# Altium schematic sheet ADC&Sensor&Relay.SchDoc
size A; SheetNumber: 6; SheetTotal: 6
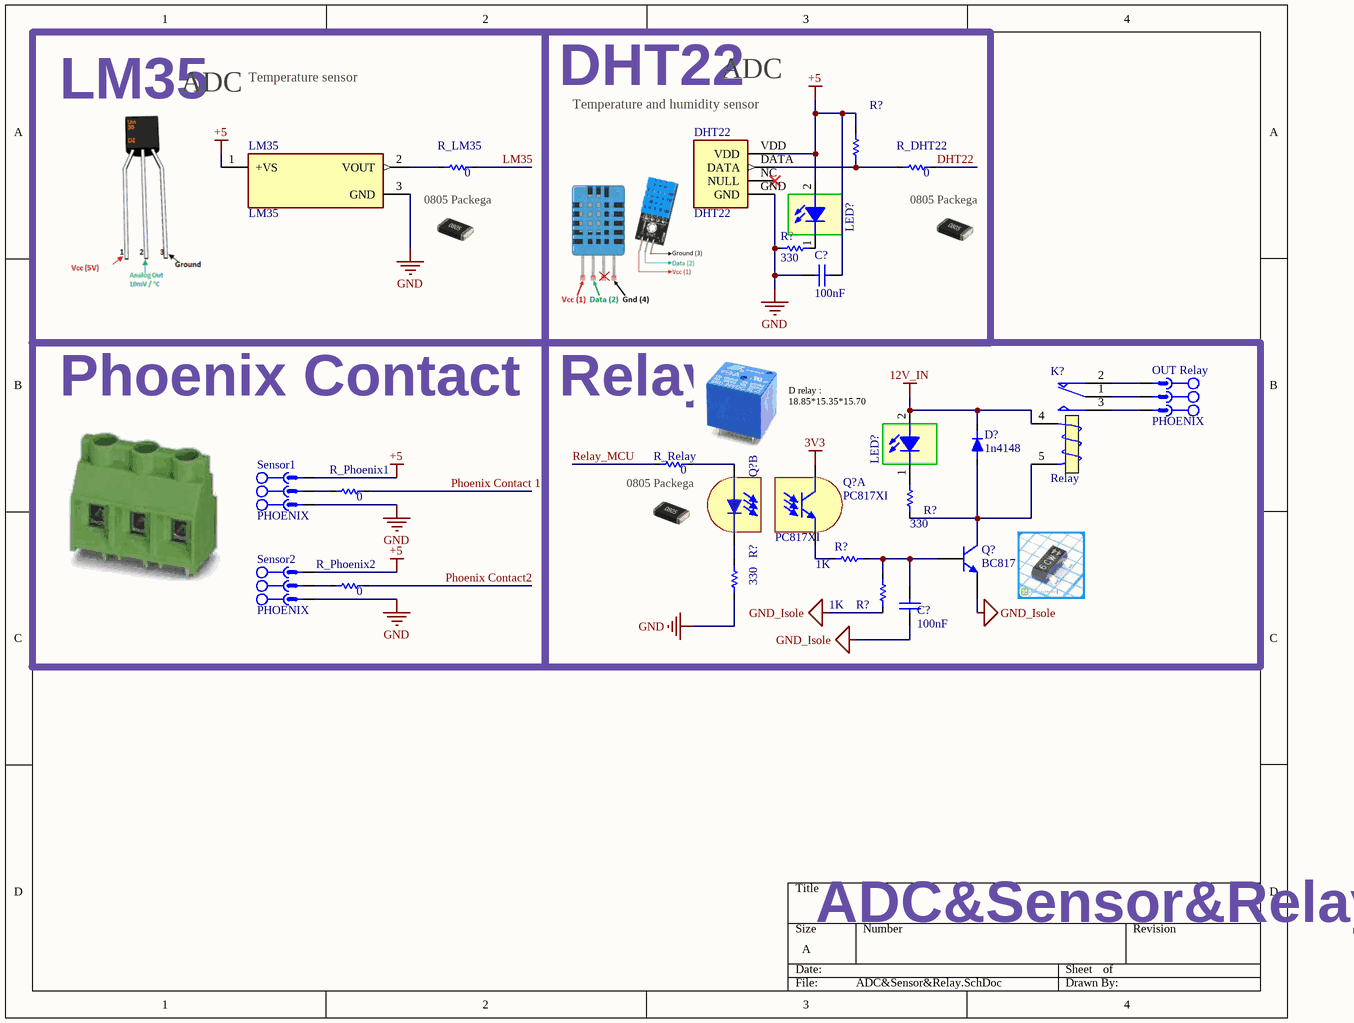
[diagram p0: ADC&Sensor&Relay.SchDoc]

## Parts
(Parts that share a designator on the sheet are numbered #1, #2 ... from top to bottom, then left to right.)
C?#1  100nF  [CAPC3413X12N]
C?#2  100nF  [MY_CAP_SMD_0603]
D?  1n4148  [SOD123]
DHT22  DHT22  [DHT22]
K?  Relay  [Relay 18.85x15.35x15.70]
LED?#1  SMD 1206 LED  [LED 1206]  (value not drawn)
LED?#2  SMD 1206 LED  [LED 1206]  (value not drawn)
LM35  LM35  [TO92127P521H735-3]
OUT_Relay  PHOENIX  [MSTB 2,5/3-G-5,08]
Q?#1  PC817XI  [SMT Gullwing Lead-Form]  (part B of 2)
Q?#2  PC817XI  [SMT Gullwing Lead-Form]  (part A of 2)
Q?#3  BC817  [SOT23_N]
R?#1  (no value)  [0805]
R?#2  330  [0805]
R?#3  330  [1206_Res]
R?#4  1K  [0805]
R?#5  1K  [0805]
R?#6  330  [1206_Res]
R_DHT22  0  [0805]
R_LM35  0  [0805]
R_Phoenix1  0  [0805]
R_Phoenix2  0  [0805]
R_Relay  0  [0805]
Sensor1  PHOENIX  [MSTB 2,5/3-G-5,08]
Sensor2  PHOENIX  [MSTB 2,5/3-G-5,08]

## Blocks framed on the sheet
LM35: LM35 R_LM35
DHT22: C?#1 DHT22 LED?#1 R?#1 R?#2 R_DHT22
Phoenix Contact: R_Phoenix1 R_Phoenix2 Sensor1 Sensor2
Relay: C?#2 D? K? LED?#2 OUT_Relay Q?#1-Q?#3 R?#3-R?#6 R_Relay

## Nets
3V3: Q?#2.4(C)
12V_IN: D?.2(K) K?.4(T1) LED?#2.2
+5: C?#1.2 DHT22.VDD LED?#1.2 LM35.1(+VS) R?#1.2 Sensor1.3 Sensor2.3
GND: C?#1.1 DHT22.GND LM35.3(GND) R?#2.1 R?#6.1 Sensor1.1 Sensor2.1
GND_Isole: C?#2.2 Q?#3.2(E) R?#5.2
DHT22: R_DHT22.2
LM35: R_LM35.2
Phoenix Contact2: R_Phoenix2.2
Phoenix Contact 1: R_Phoenix1.2
Relay_MCU: R_Relay.1
NetC?#2_1: C?#2.1 Q?#3.1(B) R?#4.2 R?#5.1
NetD?_1: D?.1(A) K?.5(T2) Q?#3.3(C) R?#3.1
NetDHT22_DATA: DHT22.DATA R?#1.1 R_DHT22.1
NetK?_1: K?.1(COM) OUT_Relay.2
NetK?_2: K?.2(NC) OUT_Relay.1
NetK?_3: K?.3(NO) OUT_Relay.3
NetLED?#1_1: LED?#1.1 R?#2.2
NetLED?#2_1: LED?#2.1 R?#3.2
NetLM35_2: LM35.2(VOUT) R_LM35.1
NetQ?#1_1: Q?#1.1(A) R_Relay.2
NetQ?#1_2: Q?#1.2(K) R?#6.2
NetQ?#2_3: Q?#2.3(E) R?#4.1
NetR_Phoenix1_1: R_Phoenix1.1 Sensor1.2
NetR_Phoenix2_1: R_Phoenix2.1 Sensor2.2

Not connected (* = marked no-connect by the designer): DHT22 NC(NULL)*

## Notes on the sheet
- ADC
- Temperature sensor
- (near DHT22) Temperature and humidity sensor
- 0805 Packega
- (near R_DHT22) 0805 Packega
- (near LED?#2) D relay : 18.85*15.35*15.70
- (near R_Relay) 0805 Packega
- ADC&Sensor&Relay

## Library data of the parts
C?#1 = CAP SMD 0805: CAP 0805; Designer: Abbas Basereh; Desc.: CAP SMD 0805; Data: 16-12-2016
C?#2 = CAP SMD_0603: 1.6 mm × 0.8 mm
D? = Diode
DHT22 = DHT22: Capacitive-type humidity and temperature module/sensor; MF: Aosong Electronics; SnapEDA_Link: https://www.snapeda.com/parts/DHT22/Aosong+Electronics/view-part/?ref=snap; Package: Package; Value: *; MP: DHT22; Check_prices: https://www.snapeda.com/parts/DHT22/Aosong+Electronics/view-part/?ref=eda
K? = Relay: SPDT Relay; Designer: Eng. Saeid Jorablo; Company: E.P.I.L; Design_Date: 2011/10/31
LED?#1 LED?#2 = LED SMD 1206
LM35 = LM35DZ/NOPB: Temperature Sensor Analog, Local 0Â°C ~ 100Â°C 10mV/Â°C TO-92-3; MP: LM35DZ; MF: Texas Instruments; Price: None; Availability: In Stock; Package: E-PKG AXIAL-LEADED-2 ON Semiconductor; Value: *; SnapEDA_Link: https://www.snapeda.com/parts/LM35DZ/Texas+Instruments/view-part/?ref=snap; Purchase-URL: https://pricing.snapeda.com/search/part/LM35DZ/?ref=eda; Check_prices: https://www.snapeda.com/parts/LM35DZ/Texas+Instruments/view-part/?ref=eda
OUT_Relay Sensor1 Sensor2 = CON_Phoenix_MSTB_03: 3 Pitch: 5.08 mm Color: green Contact surface: Tin Assembly; Manufacturer: PHOENIX CONTACT; Connector type: PCB Terminal Block; designer: ABBAS BASEREH; Max Current: 12 A; Positions: 3; Voltage: 320 V; Category: Connector; ComponentLink1Description: Header, Nominal current: 12 A Rated voltage (III/2): 320 V Number of positions: 3 Pitch: 5.08 mm Color: green Contact surface: Tin Assembly: Soldering  DESIGNER:ABBAS BASEREH; ComponentLink2Description: Reference; Mounting Technology: Through-Hole; Pin Count: 3; Revision 1: 2017-3-1; Status: Unreleased; PART.NO: PHOENIX
Q?#1 Q?#2 = PC817XI: DIP 4pin General Purpose  Photocoupler; Published: 2017-2-27; DatasheetVersion: 2017-2-27; PackageVersion: 2017-2-27; PackageReference: SMT Gullwing Lead-Form; Publisher: Abbas Basereh; PackageDescription: SOP, 4-Leads, Body 4/65x6/75mm, Pitch 2/54mm, IPC Medium Density designer:abbas basereh; ComponentLink1Description: Manufacturer Link; ComponentLink1URL: http://www.roboeq.ir/files/id/233/name/PC817.pdf/; ComponentLink2Description: DIP 4pin General Purpose
Q?#3 = BC817: 45 V, 500 mA NPN general-purpose transistors; Published: 2017-2-8; LatestRevisionDate: 2017; LatestRevisionNote: IPC-7351 Footprint Added.; DatasheetVersion: 2017; PackageVersion: 2017-2-8; PackageReference: SOT23; Publisher: Abbas Basereh; PackageDescription: 3-Pin SOT-23 Package 0.95 mm Pitch, 2.3 mm Lead Span; ComponentLink1Description: Manufacturer Link; ComponentLink1URL: http://www.nxp.com/; ComponentLink2Description: Datasheet; ComponentLink2URL: http://www.nxp.com/
R?#1-R?#6 R_DHT22 R_LM35 R_Phoenix1 R_Phoenix2 R_Relay = Res: Resistor; Published: 8-Jun-2000; LatestRevisionDate: 17-Jul-2002; LatestRevisionNote: Re-released for DXP Platform.; PackageReference: AXIAL-0.3; Publisher: Altium Limited